# EasyEDA schematic SCH_chassis-555_2025-10-31.json
TITLE: Sheet_1; REV: 1.0; Date: 2025-10-31; Sheet: 1/1; Drawn By: elishasmile3; Company: Your Company
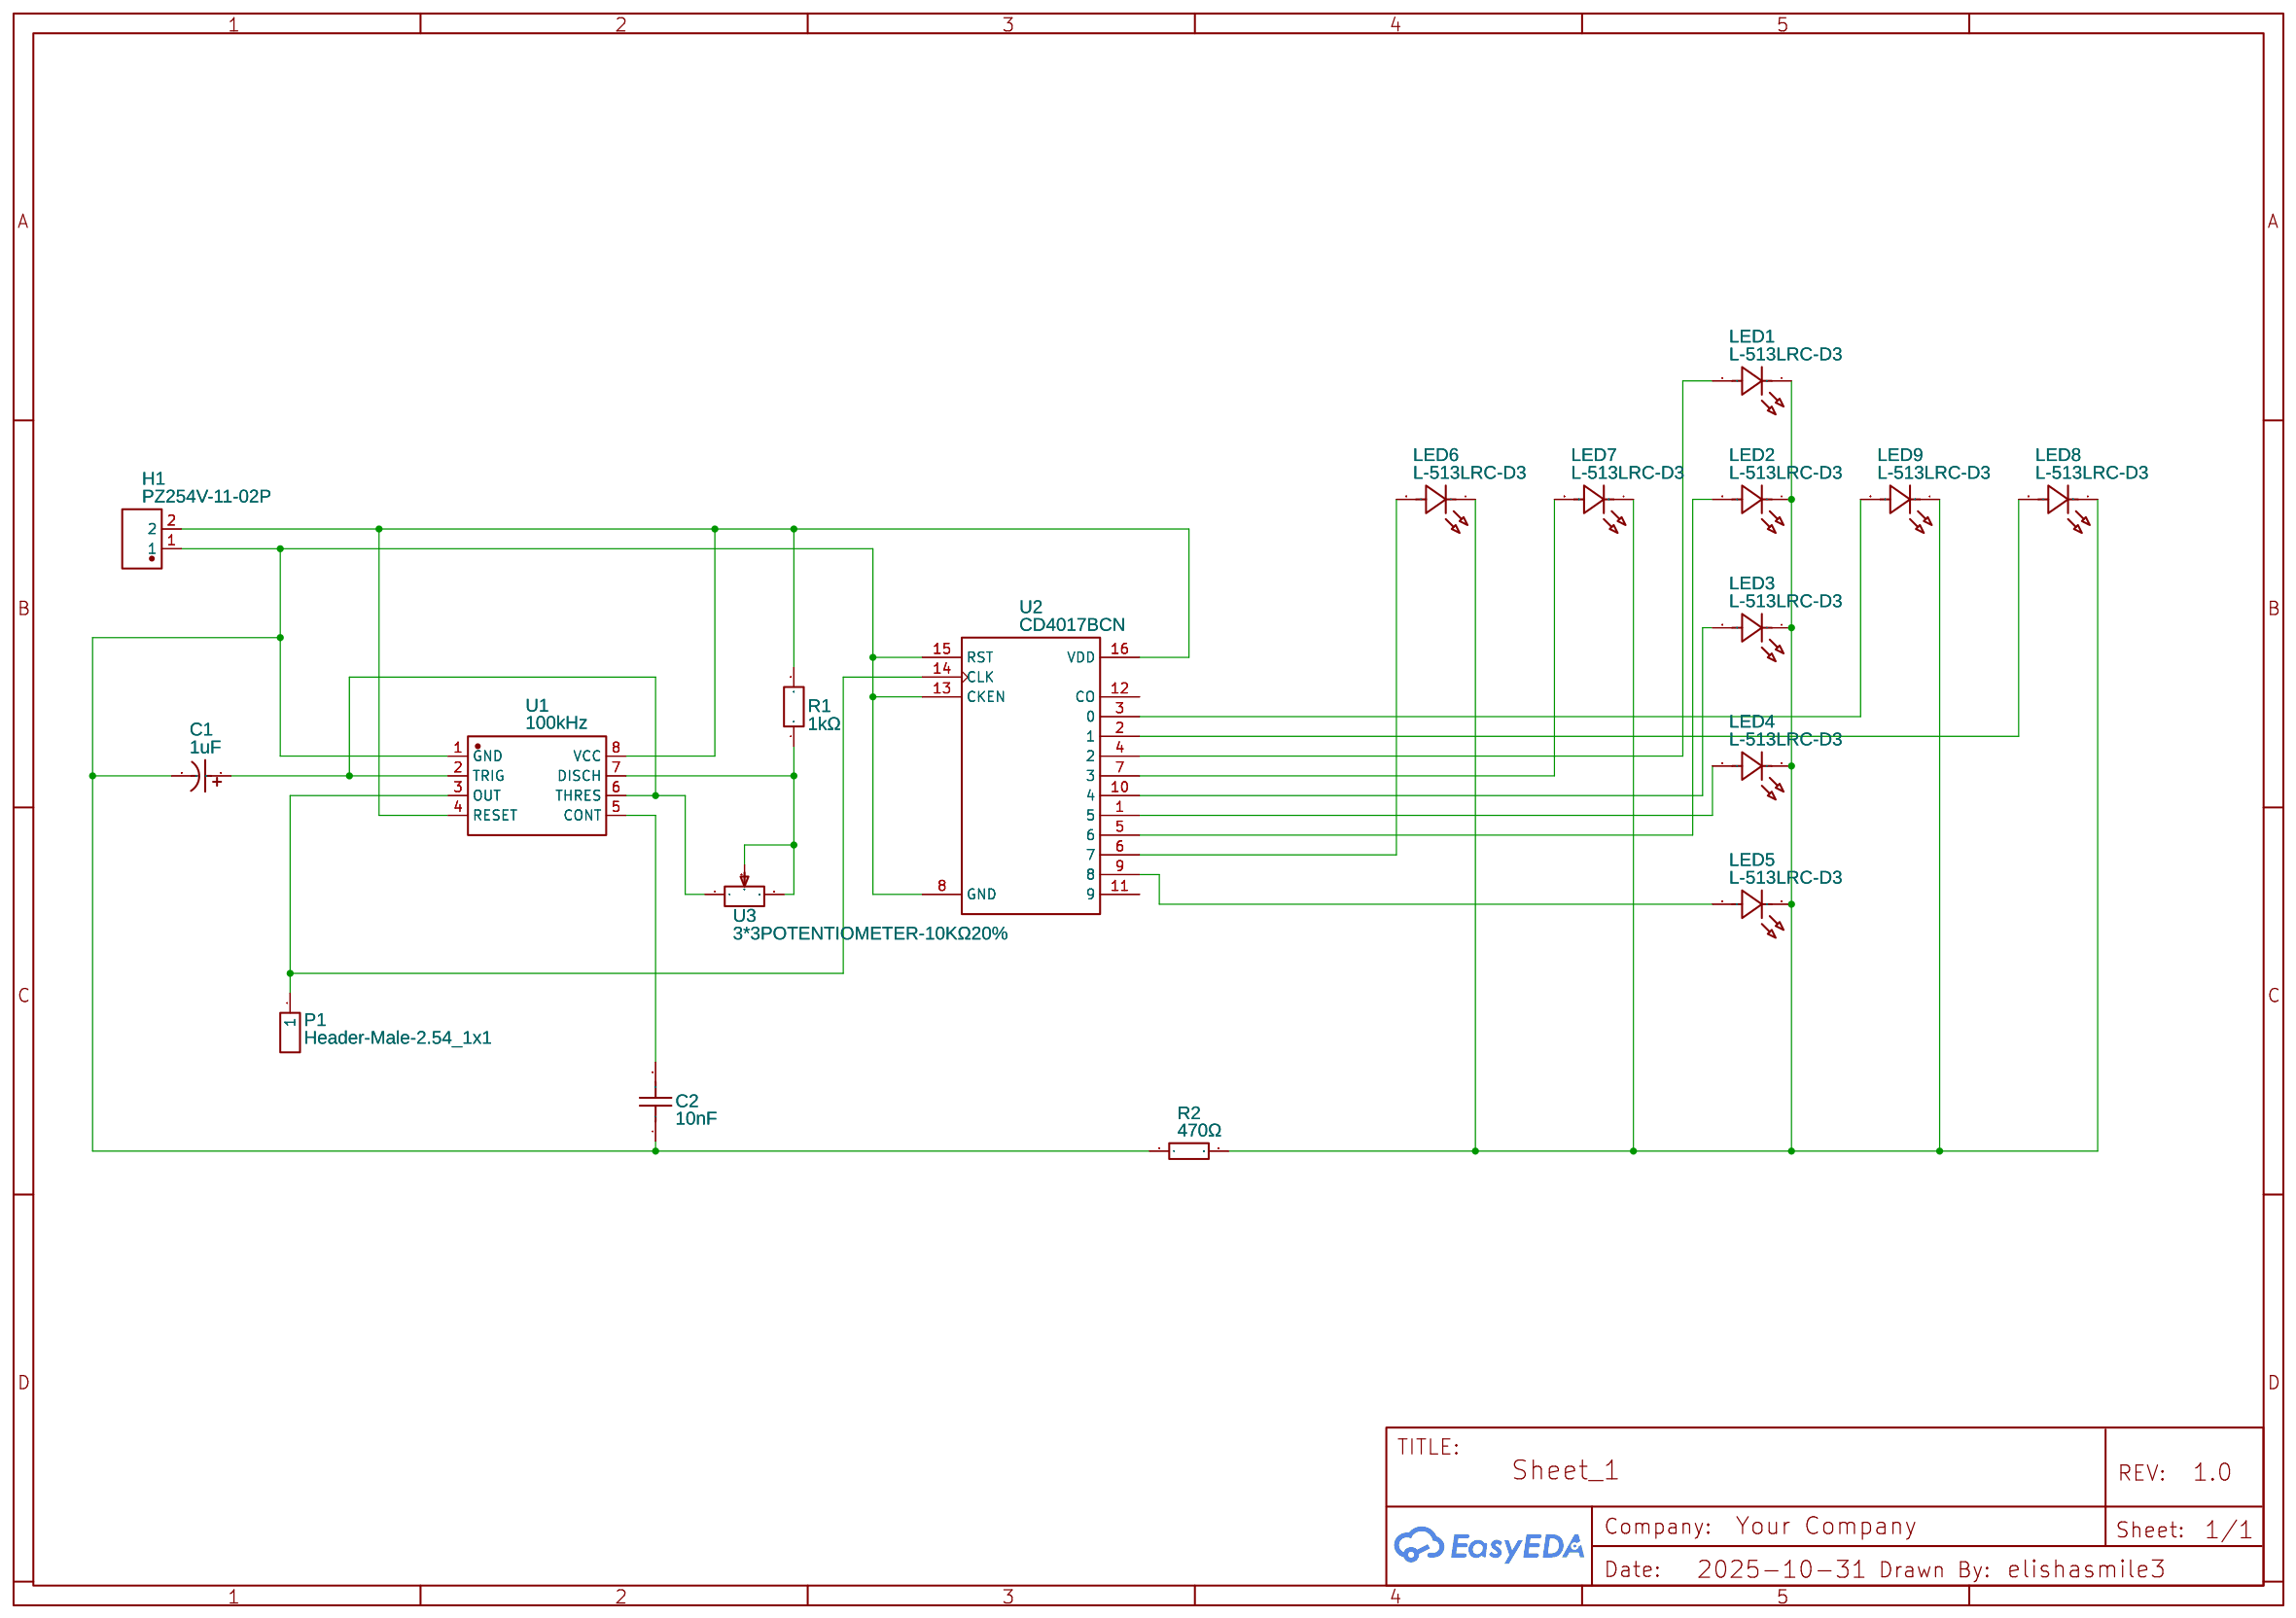
[diagram p0: schematic sheet]

## Parts
C1  1uF  [CAP-TH_BD5.0-P2.00-D0.8-FD]
C2  10nF  [CAP-TH_L8.0-W4.0-P5.00-D1.2]
H1  PZ254V-11-02P  [HDR-TH_2P-P2.54-V-M]
LED1  L-513LRC-D3  [LED-TH_BD5.0-P2.54-L-RD_WHITE]
LED2  L-513LRC-D3  [LED-TH_BD5.0-P2.54-L-RD_WHITE]
LED3  L-513LRC-D3  [LED-TH_BD5.0-P2.54-L-RD_WHITE]
LED4  L-513LRC-D3  [LED-TH_BD5.0-P2.54-L-RD_WHITE]
LED5  L-513LRC-D3  [LED-TH_BD5.0-P2.54-L-RD_WHITE]
LED6  L-513LRC-D3  [LED-TH_BD5.0-P2.54-L-RD_WHITE]
LED7  L-513LRC-D3  [LED-TH_BD5.0-P2.54-L-RD_WHITE]
LED8  L-513LRC-D3  [LED-TH_BD5.0-P2.54-L-RD_WHITE]
LED9  L-513LRC-D3  [LED-TH_BD5.0-P2.54-L-RD_WHITE]
P1  Header-Male-2.54_1x1  [HDR-TH_1P-P2.54-V-M]
R1  1kΩ  [RES-TH_BD2.3-L6.5-P10.50-D0.5]
R2  470Ω  [RES-TH_BD2.2-L6.5-P10.50-D0.6]
U1  100kHz  [DIP-8_L9.8-W6.6-P2.54-LS7.6-BL]
U2  CD4017BCN  [DIP16]
U3  3*3POTENTIOMETER-10KΩ20%  [RES-ADJ-SMD_VG039NCH]

## Library data of the parts
C1 = KF010M050C110A: Supplier: LCSC; Manufacturer: CapXon(丰宾); Supplier Part: C62934; JLCPCB Part Class: Extended Part
C2 = N09F1B103MN0B0S0N0: Contributor: LCSC; Supplier: LCSC; Supplier Part: C249157; Manufacturer: STE(松田); JLCPCB Part Class: Extended Part
H1 = PZ254V-11-02P: Contributor: LCSC; Supplier: LCSC; Supplier Part: C492401; Manufacturer: XFCN(兴飞); JLCPCB Part Class: Extended Part
LED1-LED9 = L-513LRC-D3: Contributor: LCSC; Supplier: LCSC; Supplier Part: C2844743; Manufacturer: PARALIGHT(光鼎); JLCPCB Part Class: Extended Part
P1 = Header-Male-2.54_1x1: Supplier: LCSC; Manufacturer: BOOMELE(博穆精密); Manufacturer Part: 2.54-1*1P针; Supplier Part: C81276; JLCPCB Part Class: Extended Part
R1 = MF1/4W-1KΩ±1%T52: Contributor: LCSC; Supplier: LCSC; Supplier Part: C713997; Manufacturer: 华星机电; JLCPCB Part Class: Extended Part
R2 = MFR0W4F4700A50: Supplier: LCSC; Manufacturer: UNI-ROYAL(厚声); Supplier Part: C58592; JLCPCB Part Class: Extended Part
U1 = NE555P: Supplier: LCSC; Manufacturer: TI(德州仪器); Supplier Part: C46749; JLCPCB Part Class: Extended Part
U2 = CD4017BCN: Decade CounterDivider with 10 Decoded Outputs
U3 = 3*3POTENTIOMETER-10KΩ20%: Contributor: LCSC; Supplier: LCSC; Supplier Part: C9900010776; Manufacturer: null; Manufacturer Part: 3*3Potentiometer-10kΩ20%; JLCPCB Part Class: Extended Part

## Nets
Net-(C1-1): C1.1 U1.2(TRIG) U1.6(THRES) U3.1
Net-(C1-2): C1.2 C2.1 H1.1 R2.1 U1.1(GND) U2.8(GND) U2.13(CKEN) U2.15(RST)
Net-(C2-2): C2.2 U1.5(CONT)
Net-(H1-2): H1.2 R1.2 U1.4(RESET) U1.8(VCC) U2.16(VDD)
Net-(LED1-1): LED1.1(K) LED2.1(K) LED3.1(K) LED4.1(K) LED5.1(K) LED6.1(K) LED7.1(K) LED8.1(K) LED9.1(K) R2.2
Net-(LED1-2): LED1.2(A) U2.4(2)
Net-(LED2-2): LED2.2(A) U2.5(6)
Net-(LED3-2): LED3.2(A) U2.10(4)
Net-(LED4-2): LED4.2(A) U2.1(5)
Net-(LED5-2): LED5.2(A) U2.9(8)
Net-(LED6-2): LED6.2(A) U2.6(7)
Net-(LED7-2): LED7.2(A) U2.7(3)
Net-(LED8-2): LED8.2(A) U2.2(1)
Net-(LED9-2): LED9.2(A) U2.3(0)
Net-(P1-1): P1.1 U1.3(OUT) U2.14(CLK)
Net-(R1-1): R1.1 U1.7(DISCH) U3.2 U3.3

Not connected (* = marked no-connect by the designer): U2 11(9) 12(CO)
